# Altium project tp2.PrjPcb
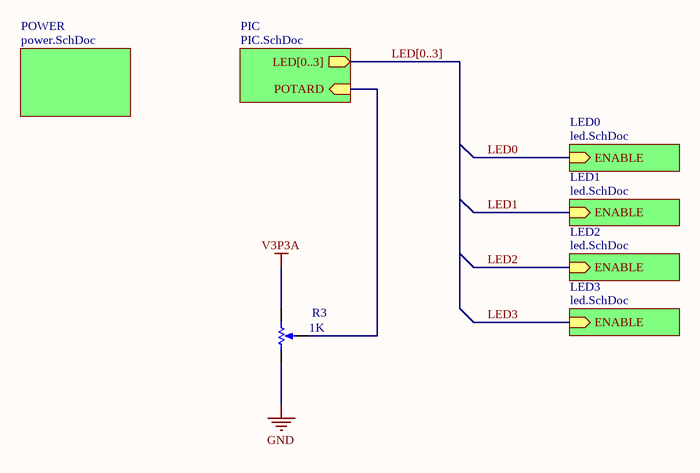
[diagram p0: TP2.SchDoc]
3 sheets, 22 parts. Net scope: hierarchical (ports join the sheet entries above them; power ports are global).
Board file: PCB1.PcbDoc
Sheets:
  TP2.SchDoc
    LED1 = led.SchDoc
    LED2 = led.SchDoc
    LED3 = led.SchDoc
    LED0 = led.SchDoc
    POWER = power.SchDoc

## Sheet TP2.SchDoc
size A

### Parts
R3  1K  [PDB181-K415K-102A2]

### Sub-sheets
LED0 = led.SchDoc: ENABLE (in)
LED1 = led.SchDoc: ENABLE (in)
LED2 = led.SchDoc: ENABLE (in)
LED3 = led.SchDoc: ENABLE (in)
PIC = PIC.SchDoc (file not in this document): LED[0..3] (out), POTARD (in)
POWER = power.SchDoc: no entries

### Nets
GND: R3.1(TOP)
V3P3A: R3.2(BOT)
NetR3_3: R3.3(TAP) ; sheet PIC/POTARD

### Buses and harness runs
bus LED[0..3] = sheet PIC/LED[0..3]

### Library data of the parts
R3 = RPot: Potentiometer; Sim Note: Enter the Resistance value and the set point into parameter fields.; Set Position: 0.5; Published: 8-Jun-2000; LatestRevisionDate: 17-Jul-2002; LatestRevisionNote: Re-released for DXP Platform.; PackageReference: VR5; Publisher: Altium Limited; PackageDescription: Variable Resistor, Thru-Hole; 3 Leads; Value: 1K

## Sheet led.SchDoc
size A
Used 4 times, as channels LED1, LED2, LED3, LED0. Parts and nets are listed once, with the designators drawn on the sheet.
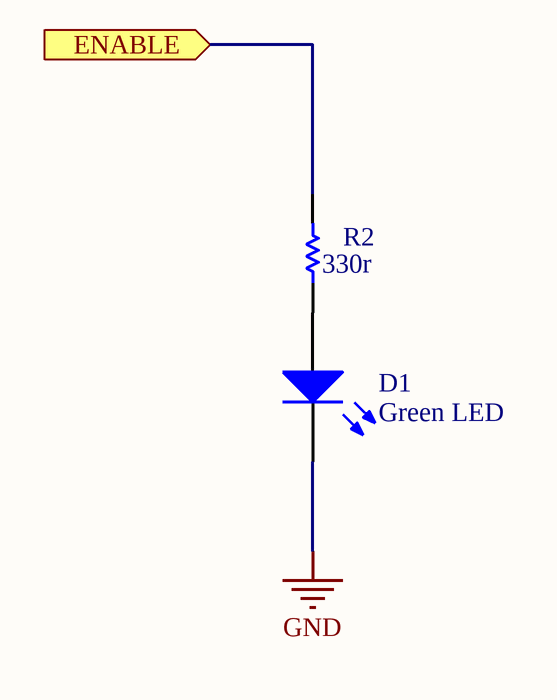
[diagram p1: led.SchDoc]

### Parts
D1  Green LED  [LED 0805]
R2  330r  [RESC1608N]

### Ports
ENABLE (in)

### Nets
GND: D1.2(K)
ENABLE: R2.2 ; port ENABLE
NetD1_1: D1.1(A) R2.1

### Channels
LED1: designators end in _LED1; ports ENABLE=LED1
LED2: designators end in _LED2; ports ENABLE=LED2
LED3: designators end in _LED3; ports ENABLE=LED3
LED0: designators end in _LED0; ports ENABLE=LED0

### Library data of the parts
D1 = LED0: Typical INFRARED GaAs LED; Published: 8-Jun-2000; LatestRevisionDate: 08-Jul-2005; LatestRevisionNote: Mech Layer 1 removed.; PackageReference: LED-0; Publisher: Altium Limited; PackageDescription: LED; 2 Leads
R2 = Res1: Resistor; Published: 8-Jun-2000; LatestRevisionDate: 17-Jul-2002; LatestRevisionNote: Re-released for DXP Platform.; PackageReference: AXIAL-0.3; Publisher: Altium Limited; PackageDescription: Axial Device, Thru-Hole; 2 Leads; 0.3 in Pin Spacing; Value: 330r

## Sheet power.SchDoc
size A
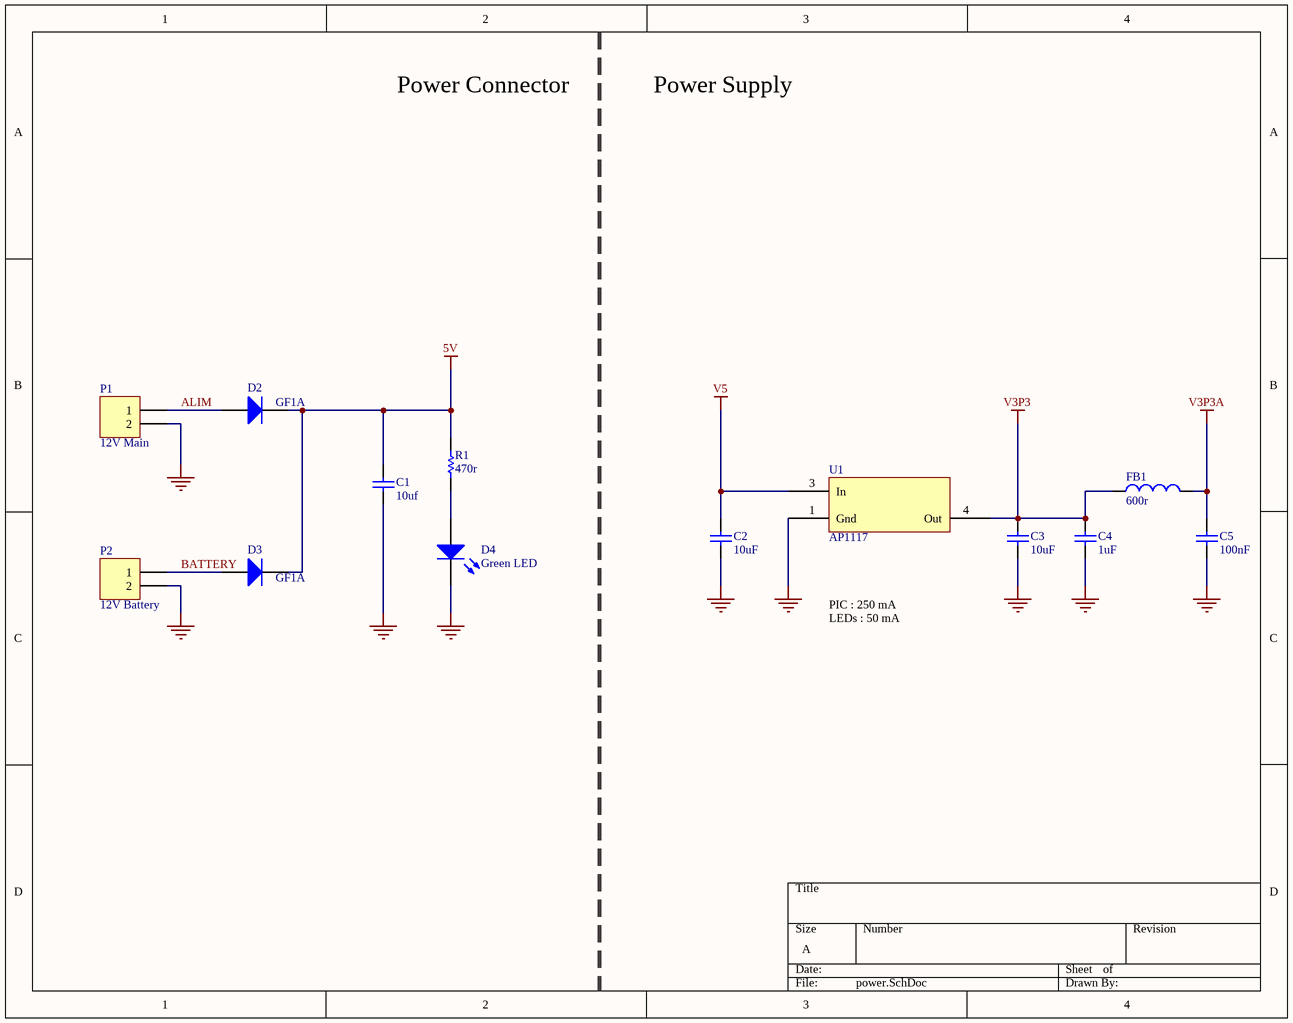
[diagram p2: power.SchDoc]

### Parts
C1  10uf  [CAPC1608N]
C2  10uF  [CAPC1608N]
C3  10uF  [CAPC1608N]
C4  1uF  [CAPC1608N]
C5  100nF  [CAPC1608N]
D2  GF1A  [SMA/DO-214AC_21]
D3  GF1A  [SMA/DO-214AC_21]
D4  Green LED  [LED 0805]
FB1  600r  [0402-A]
P1  12V Main  [PHOENIX_1985195]
P2  12V Battery  [PHOENIX_1985195]
R1  470r  [RESC1608N]
U1  AP1117  [TD03B_N]

### Nets
5V: C1.2 D2.2(K) D3.2(K) R1.2
GND: C1.1 C2.1 C3.1 C4.1 C5.1 D4.2(K) P1.2 P2.2 U1.1(Gnd)
V3P3: C3.2 C4.2 FB1.1 U1.4(Out)
V3P3A: C5.2 FB1.2
V5: C2.2 U1.3(In)
ALIM: D2.1(A) P1.1
BATTERY: D3.1(A) P2.1
NetD4_1: D4.1(A) R1.1

### Notes on the sheet
- Power Connector
- Power Supply
- PIC : 250 mA
- LEDs : 50 mA

### Library data of the parts
C1-C5 = Cap: Capacitor; Value: 100pF; Published: 8-Jun-2000; LatestRevisionDate: 17-Jul-2002; LatestRevisionNote: Re-released for DXP Platform.; PackageReference: RAD-0.3; Publisher: Altium Limited; PackageDescription: Radial Cap, Thru-Hole; 2 Leads; 0.3 in Pin Spacing
D2 D3 = Diode: Default Diode; Published: 8-Jun-2000; LatestRevisionDate: 17-Jul-2002; LatestRevisionNote: Re-released for DXP Platform.; PackageVersion: Sep-1996; PackageReference: SMC; Publisher: Altium Limited; PackageDescription: DO-214-AB/SMC; 2 C-Bend Leads; Body 7.9 x 5.9 mm, inc. leads (LxW); Code_JEDEC: DO-214-AB
D4 = LED0: Typical INFRARED GaAs LED; Published: 8-Jun-2000; LatestRevisionDate: 08-Jul-2005; LatestRevisionNote: Mech Layer 1 removed.; PackageReference: LED-0; Publisher: Altium Limited; PackageDescription: LED; 2 Leads
FB1 = Inductor: Code_IEC: 1005; Value: 10mH; Published: 8-Jun-2000; LatestRevisionDate: 29-May-2009; LatestRevisionNote: IPC-7351 Footprint Added.; PackageReference: 0402-A; Publisher: Altium Limited; PackageDescription: Chip Inductor; Code_JEITA: 0402
P1 P2 = Header 2: Header, 2-Pin; LatestRevisionDate: 17-Jul-2002; LatestRevisionNote: Re-released for DXP Platform.; Publisher: Altium Limited
R1 = Res1: Resistor; Value: 470k; Published: 8-Jun-2000; LatestRevisionDate: 17-Jul-2002; LatestRevisionNote: Re-released for DXP Platform.; PackageReference: AXIAL-0.3; Publisher: Altium Limited; PackageDescription: Axial Device, Thru-Hole; 2 Leads; 0.3 in Pin Spacing

## Nets that join several sheets
GND: TP2 (R3.1), LED1 (D1_LED1.2), LED2 (D1_LED2.2), LED3 (D1_LED3.2), LED0 (D1_LED0.2), power (9 pins)
V3P3A: TP2 (R3.2), power (C5.2 FB1.2)